# EAGLE design tick-box-1591A-mk-2.2 (EAGLE 6.5.0)
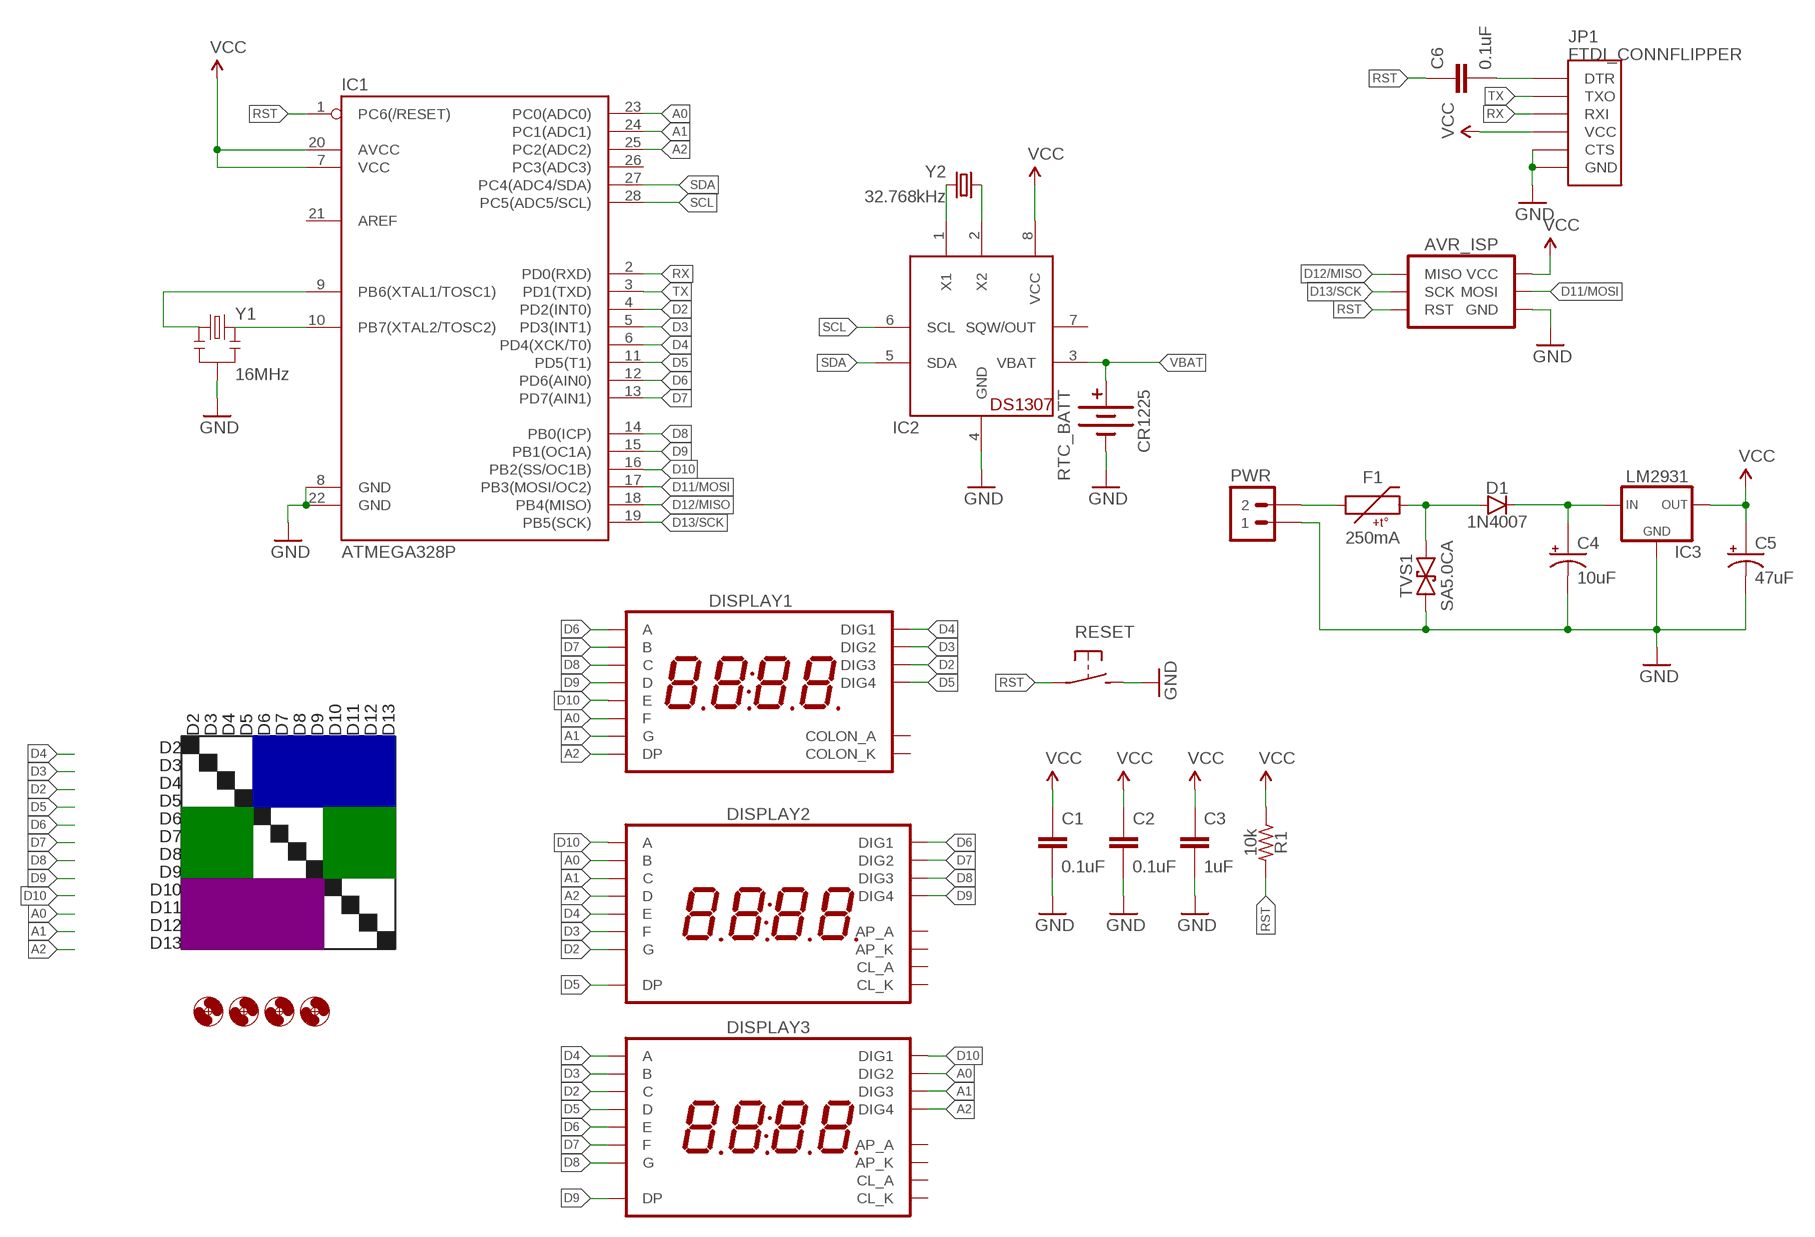
[diagram p0: schematic, sheet 1]

## Parts
AVR_ISP  AVR_SPI_PRG_6PTH  [2X3]
C1  0.1uF  CAPACITOR-CERAMIC025-024X044  [C025-024X044]
C2  0.1uF  CAPACITOR-CERAMIC025-024X044  [C025-024X044]
C3  1uF  CAPACITOR-CERAMIC025-024X044  [C025-024X044]
C4  10uF  CAPACITOR-POLARIZEDE2-5  [E2-5]
C5  47uF  CAPACITOR-POLARIZEDE2.5-6  [E2,5-6]
C6  0.1uF  CAPACITOR-CERAMIC025-024X044  [C025-024X044]
D1  1N4007  DIODEPTH-10.68MM  [DIODE-10.16MM]
DISPLAY1  7SEG_4DIGIT_COLON14.2MM-CC-NS  [7SEG_4DIG_NS]
DISPLAY2  7SEG_4DIGIT_COLON_APOS  [7SEG_4DIG_10MM]
DISPLAY3  7SEG_4DIGIT_COLON_APOS  [7SEG_4DIG_10MM]
F1  250mA  PTCPTH-5.08MM  [PTC-PTH-5.08MM]
H1  HOLE#2  [HOLE-#2]
H2  HOLE#2  [HOLE-#2]
H3  HOLE#2  [HOLE-#2]
H4  HOLE#2  [HOLE-#2]
IC1  ATMEGA328P  ATMEGA328P_PDIP  [DIL28-3]
IC2  DS1307  [DIL08]
IC3  LM2931  V_REG_78XXTO-92-INLINE  [TO-92-AMMO]
JP1  FTDI_CONNFLIPPER  [FTDI_CONN_FLIP]
PWR  M02PTH-CENTERED  [1X02-CENTER]
R1  10k  RESISTORPTH-AXIAL-6.35MM  [RESISTOR-AXIAL-PTH-6.35MM]
RESET  SPST-NO-TACT3MM-PTH-SMALL-PADS  [DTS-3-SMALL-PADS]
RTC_BATT  CR1225  BATTERY12PTH_TOPLOAD  [BATTCON_12MM_PTH_TOPLOAD]
TVS1  SA5.0CA  TVSDO-41-10.16MM  [DO-41-TVS-BI-10.16MM]
Y1  16MHz  RESONATORPTH  [RESONATOR-PTH]
Y2  32.768kHz  CRYSTALTC26H  [TC26H]

## Nets
A0: DISPLAY1.P$12(F) DISPLAY2.16(B) DISPLAY3.2(DIG2) IC1.23(PC0(ADC0))
A1: DISPLAY1.P$5(G) DISPLAY2.13(C) DISPLAY3.6(DIG3) IC1.24(PC1(ADC1))
A2: DISPLAY1.P$3(DP) DISPLAY2.3(D) DISPLAY3.8(DIG4) IC1.25(PC2(ADC2))
D2: DISPLAY1.P$10(DIG3) DISPLAY2.15(G) DISPLAY3.13(C) IC1.4(PD2(INT0))
D3: DISPLAY1.P$11(DIG2) DISPLAY2.11(F) DISPLAY3.16(B) IC1.5(PD3(INT1))
D4: DISPLAY1.P$14(DIG1) DISPLAY2.5(E) DISPLAY3.14(A) IC1.6(PD4(XCK/T0))
D5: DISPLAY1.P$6(DIG4) DISPLAY2.7(DP) DISPLAY3.3(D) IC1.11(PD5(T1))
D6: DISPLAY1.P$13(A) DISPLAY2.1(DIG1) DISPLAY3.5(E) IC1.12(PD6(AIN0))
D7: DISPLAY1.P$9(B) DISPLAY2.2(DIG2) DISPLAY3.11(F) IC1.13(PD7(AIN1))
D8: DISPLAY1.P$4(C) DISPLAY2.6(DIG3) DISPLAY3.15(G) IC1.14(PB0(ICP))
D9: DISPLAY1.P$2(D) DISPLAY2.8(DIG4) DISPLAY3.7(DP) IC1.15(PB1(OC1A))
D10: DISPLAY1.P$1(E) DISPLAY2.14(A) DISPLAY3.1(DIG1) IC1.16(PB2(SS/OC1B))
D11/MOSI: AVR_ISP.4(MOSI) IC1.17(PB3(MOSI/OC2))
D12/MISO: AVR_ISP.1(MISO) IC1.18(PB4(MISO))
D13/SCK: AVR_ISP.3(SCK) IC1.19(PB5(SCK))
GND: AVR_ISP.6(GND) C1.2 C2.2 C3.2 C4.- C5.- IC1.8(GND) IC1.22(GND) IC2.4(GND) IC3.2(GND) JP1.CTS JP1.GND PWR.1 RESET.2 RTC_BATT.- TVS1.P$1 Y1.2
N$1: IC1.10(PB7(XTAL2/TOSC2)) Y1.3
N$2: IC1.9(PB6(XTAL1/TOSC1)) Y1.1
N$3: D1.A F1.P$2 TVS1.P$2
N$4: F1.P$1 PWR.2
N$5: C4.+ D1.C IC3.1(IN)
N$6: IC2.2(X2) Y2.1
N$7: C6.2 JP1.DTR
N$8: IC2.1(X1) Y2.2
RST: AVR_ISP.5(RST) C6.1 IC1.1(PC6(/RESET)) R1.P$2 RESET.1
RX: IC1.2(PD0(RXD)) JP1.RXI
SCL: IC1.28(PC5(ADC5/SCL)) IC2.6(SCL)
SDA: IC1.27(PC4(ADC4/SDA)) IC2.5(SDA)
TX: IC1.3(PD1(TXD)) JP1.TXO
VBAT: IC2.3(VBAT) RTC_BATT.+
VCC: AVR_ISP.2(VCC) C1.1 C2.1 C3.1 C5.+ IC1.7(VCC) IC1.20(AVCC) IC2.8(VCC) IC3.3(OUT) JP1.VCC R1.P$1
Unconnected: DISPLAY1.P$7(COLON_K) DISPLAY1.P$8(COLON_A) DISPLAY2.4(CL_A) DISPLAY2.9(AP_K) DISPLAY2.10(AP_A) DISPLAY2.12(CL_K) DISPLAY3.4(CL_A) DISPLAY3.9(AP_K) DISPLAY3.10(AP_A) DISPLAY3.12(CL_K) IC1.21(AREF) IC1.26(PC3(ADC3)) IC2.7(SQW/OUT)

## Notes on the sheet
- D2 | D3 | D4 | D5 | D6 | D7 | D8 | D9 | D10 | D11 | D12 | D13
- D2
- D3
- D4
- D5
- D6
- D7
- D8
- D9
- D10
- D11
- D12
- D13

## Library data of the parts
AVR_ISP = A_butts:AVR_SPI_PRG_6: AVR ISP 6 Pin This is the reduced ISP connector for AVR programming. Common on Arduino. This footprint will take up less PCB space and can be used with a 10-pin to 6-pin adapter such as SKU: BOB-08508 **Special note about "TEST_POINT" package. The stop mask is on the top side, so if you want your programming test points to be on the bottom of your board, make sure to place this package on the bottom side of the board. This also ensure that the orientation to program from the bottom side will be correct.
C1-C3 C6 = A_butts:CAPACITOR-CERAMIC: CAPACITOR, European symbol
C4 C5 = A_butts:CAPACITOR-POLARIZED: POLARIZED CAPACITOR, American symbol
D1 = A_butts:DIODE: Diode These are standard reverse protection diodes and small signal diodes. SMA package can handle up to about 1A. SOD-323 can handle about 200mA. What the SOD-323 package when ordering, there are some mfgs out there that are 5-pin packages.
DISPLAY1 = A_butts:7SEG_4DIGIT_COLON
DISPLAY2 DISPLAY3 = A_butts:7SEG_4DIGIT_COLON_APOS
F1 = A_butts:PTC: Resettable Fuse PTC Resettable Fuse. Spark Fun Electronics SKU : COM-08357
H1-H4 = A_butts:HOLE: MOUNTING HOLE with drill center marker
IC1 = A_butts:ATMEGA328P_PDIP: uC used in the Arduino 32kb flash, 1k EEPROM, 2k SRAM This is the through-hole version of this chip.
IC2 = A_butts:DS1307: DS1307 Real time clock (RTC) with battery backup ability. Talk to it via i2c
IC3 = A_butts:V_REG_78XX: Voltage Regulator Standard 7805 5V regulator. IGO (Input Ground Output). Spark Fun Electronics SKU : COM-00107
JP1 = A_butts:FTDI_CONN: Connector which mates to FTDI basic or FTDI cable.
PWR = A_butts:M02: Standard 2-pin 0.1" header. Use with - straight break away headers ( PRT-00116) - right angle break away headers (PRT-00553) - swiss pins (PRT-00743) - machine pins (PRT-00117) - female headers (PRT-00115) Molex polarized connector foot print use with: PRT-08233 with associated crimp pins and housings. 2.54_SCREWTERM for use with PRT-10571. 3.5mm Screw Terminal footprints for PRT-08084 5mm Screw Terminal footprints for use with PRT-08433
R1 = A_butts:RESISTOR: RESISTOR, American symbol
RESET = A_butts:SPST-NO-TACT
RTC_BATT = A_butts:BATTERY: Battery Holders Various common sizes : AA, AAA, 20mm coin cell and 12mm coin cell. 20MM_4LEGS, BATT-10373
TVS1 = A_butts:TVS: Transient voltage suppressor- prevents ESD on inputs. Ignore package description- MBRA140 is NOT this type of part!!!
Y1 = A_butts:RESONATOR: Resonator Small SMD resonator. Used, eg, on the Arduino Pro/ Pro Mini boards. 8MHz- XTAL-08895 16MHz- XTAL-08900
Y2 = A_butts:CRYSTAL: Various standard crystals. Proven footprints. Spark Fun Electronics SKU : COM-00534

## Board
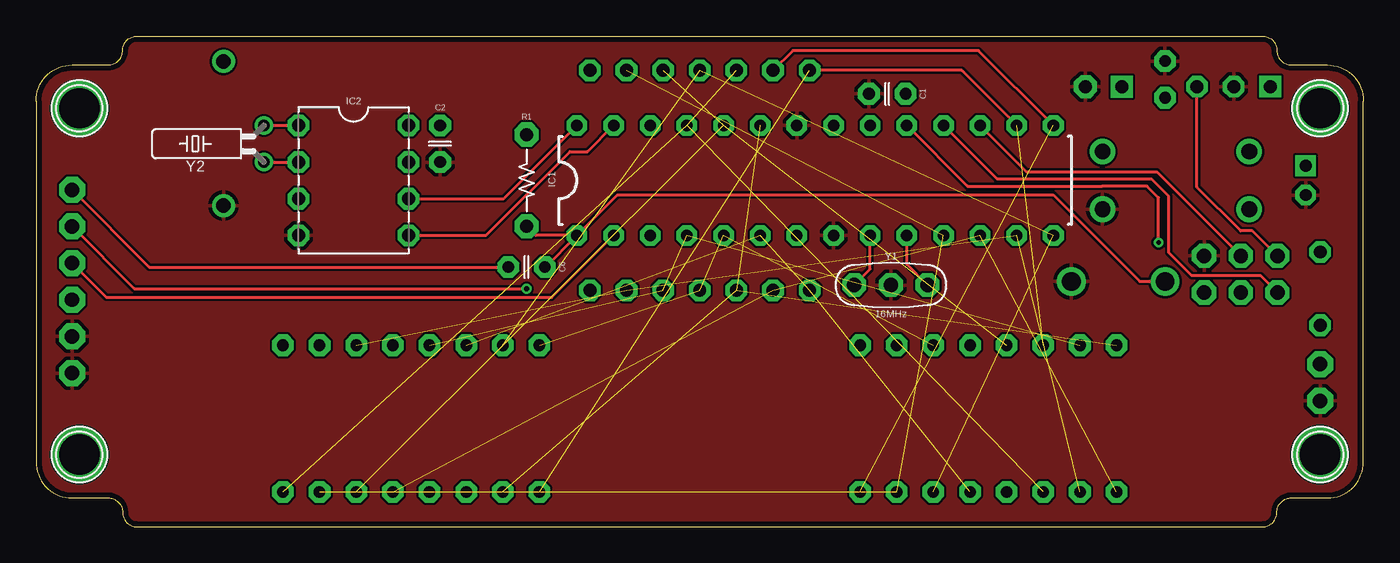
[diagram p1: board, top side]
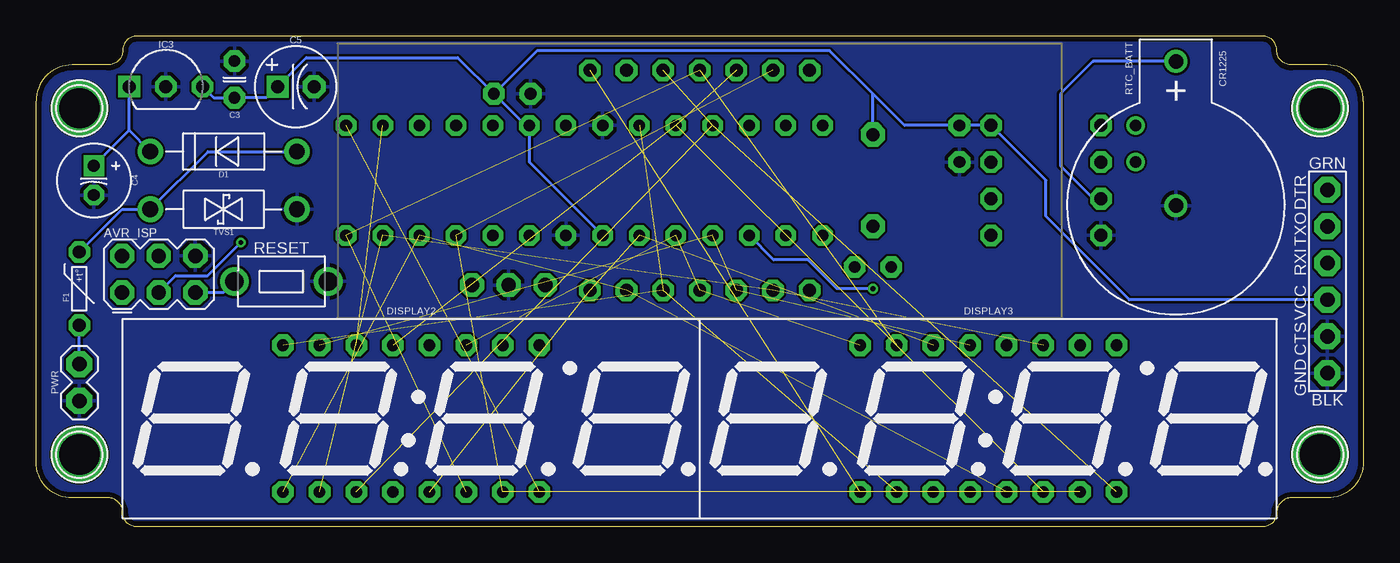
[diagram p2: board, bottom side, seen from below]

Size 92 x 34 mm. Coordinates in mm from the lower left corner, seen from the top.
Outline: 87,32 89.5,32 arc-90 92,29.5 92,4.5 arc-90 89.5,2 87,2 arc90 86,1 arc-90 85,0 7,0 arc-90 6,1 arc90 5,2 2.5,2 arc-90 0,4.5 0,29.5 arc-90 2.5,32 5,32 arc90 6,33 arc-90 7,34 85,34 arc-90 86,33 arc90 87,32
Copper layers (1*16): Top 0.0356mm / dielectric 1.5011mm / Bottom 0.0356mm
Design rules "LaenPCBOrder_2": minimum track width 6mil, minimum drill 13mil, track to track 6mil, track to pad 6mil, pad to pad 6mil, via to via 6mil, smd to smd 6mil, copper to edge 15mil, drill to drill 6mil, minimum pad ring 7mil, minimum via ring 7mil, stop-mask expansion 3mil, vias tented up to drill 20mil, thermal gap 10mil

### Footprints (pad centres in the part's own frame; a part is rotated, then mirrored left to right if it is on the bottom)
2X3 = drill 1 pad 1.676 octagon: 1 -2.54,-1.27; 2 -2.54,1.27; 3 0,-1.27; 4 0,1.27; 5 2.54,-1.27; 6 2.54,1.27
C025-024X044 = drill 0.813 pad 1.5 octagon: 1 -1.27,0; 2 1.27,0
E2-5 = drill 0.813 pad 1.422 square: + -1.016,0 | drill 0.813 pad 1.422 octagon: - 1.016,0
E2,5-6 = drill 0.9 pad 1.524 square: + -1.27,0 | drill 0.9 pad 1.6 octagon: - 1.27,0
DIODE-10.16MM = drill 1.1 pad 1.778: A -5.08,0; C 5.08,0
7SEG_4DIG_NS = drill 0.9 pad 1.5 octagon: P$1 -7.62,7.62; P$2 -5.08,7.62; P$3 -2.54,7.62; P$4 0,7.62; P$5 2.54,7.62; P$6 5.08,7.62; P$7 7.62,7.62; P$8 7.62,-7.62; P$9 5.08,-7.62; P$10 2.54,-7.62; P$11 0,-7.62; P$12 -2.54,-7.62; P$13 -5.08,-7.62; P$14 -7.62,-7.62
7SEG_4DIG_10MM = drill 0.8 pad 1.5 octagon: 1 -8.89,-5.08; 2 -6.35,-5.08; 3 -3.81,-5.08; 4 -1.27,-5.08; 5 1.27,-5.08; 6 3.81,-5.08; 7 6.35,-5.08; 8 8.89,-5.08; 9 8.89,5.08; 10 6.35,5.08; 11 3.81,5.08; 12 1.27,5.08; 13 -1.27,5.08; 14 -3.81,5.08; 15 -6.35,5.08; 16 -8.89,5.08
PTC-PTH-5.08MM = drill 0.9 pad 1.5 octagon: P$1 -2.54,0; P$2 2.54,0
HOLE-#2 = drill 2.8 pad 3.81: P$1 0,0
DIL28-3 = drill 0.8 pad 1.422 octagon: 1 -16.51,-3.81; 2 -13.97,-3.81; 3 -11.43,-3.81; 4 -8.89,-3.81; 5 -6.35,-3.81; 6 -3.81,-3.81; 7 -1.27,-3.81; 8 1.27,-3.81; 9 3.81,-3.81; 10 6.35,-3.81; 11 8.89,-3.81; 12 11.43,-3.81; 13 13.97,-3.81; 14 16.51,-3.81; 15 16.51,3.81; 16 13.97,3.81; 17 11.43,3.81; 18 8.89,3.81; 19 6.35,3.81; 20 3.81,3.81; 21 1.27,3.81; 22 -1.27,3.81; 23 -3.81,3.81; 24 -6.35,3.81; 25 -8.89,3.81; 26 -11.43,3.81; 27 -13.97,3.81; 28 -16.51,3.81
DIL08 = drill 0.9 pad 1.5 octagon: 1 -3.81,-3.81; 2 -1.27,-3.81; 3 1.27,-3.81; 4 3.81,-3.81; 5 3.81,3.81; 6 1.27,3.81; 7 -1.27,3.81; 8 -3.81,3.81
TO-92-AMMO = drill 0.9 pad 1.5 square: 1 -2.54,0 | drill 0.9 pad 1.5 octagon: 2 0,0; 3 2.54,0
FTDI_CONN_FLIP = drill 1 pad 1.8 octagon: CTS 3.81,0; DTR -6.35,0; GND 6.35,0; RXI -1.27,0; TXO -3.81,0; VCC 1.27,0
1X02-CENTER = drill 1 pad 1.8 octagon: 1 -1.27,0; 2 1.27,0
RESISTOR-AXIAL-PTH-6.35MM = drill 0.9 pad 1.676 octagon: P$1 -3.175,0; P$2 3.175,0
DTS-3-SMALL-PADS = drill 1.3 pad 2: 1 -3.25,0; 2 3.25,0
BATTCON_12MM_PTH_TOPLOAD = drill 1 pad 1.6: + 10,0; - 0,0
DO-41-TVS-BI-10.16MM = drill 1.1 pad 1.778: P$1 -5.08,0; P$2 5.08,0
RESONATOR-PTH = drill 1 pad 1.65 octagon: 1 -2.54,0; 2 0,0; 3 2.54,0
TC26H = drill 0.8 pad 1.27: 1 -1.27,0; 2 1.27,0

### Placement (x,y rotation side)
AVR_ISP  83.5,17.5 0 bottom
C1  59,30 180 top
C2  28,26.54 270 top
C3  78.25,31 90 bottom
C4  88,24 270 bottom
C5  74,30.5 0 bottom
C6  34,18 180 top
D1  79,26 180 bottom
DISPLAY1  46,24 0 bottom
DISPLAY2  66,7.5 0 bottom
DISPLAY3  26,7.5 0 bottom
F1  89,16.5 90 bottom
H1  3,5 0 top
H2  89,5 0 top
H3  89,29 0 top
H4  3,29 0 top
IC1  54,24 0 top
IC2  22,24 270 top
IC3  83,30.5 0 bottom
JP1  2.5,17 270 bottom
PWR  89,10 90 bottom
R1  34,24 270 top
RESET  75,17 0 bottom
RTC_BATT  13,22.25 90 bottom
TVS1  79,22 180 bottom
Y1  59.25,16.75 0 top
Y2  15.8,26.54 90 top

### Tracks (layer width: path | path; a pad name or v marks a point on that pad's centre or on a via)
A0  (3 unrouted)
A1  (3 unrouted)
A2  (3 unrouted)
D2  (3 unrouted)
D3  (3 unrouted)
D4  (3 unrouted)
D5  (3 unrouted)
D6  (3 unrouted)
D7  (3 unrouted)
D8  (3 unrouted)
D9  (2 unrouted)
  Top 0.2: DISPLAY1.P$2 52.46,33 65.32,33 IC1.15
D10  (2 unrouted)
  Top 0.2: IC1.16 64.16,31.62 DISPLAY1.P$1
D11/MOSI
  Top 0.2: AVR_ISP.4 77.67,24.6 68.64,24.6 IC1.17
D12/MISO
  Top 0.2: AVR_ISP.1 84.87,17.4 80.1,17.4 78.5,19 78.5,22.9 77.3,24.1 66.6,24.1 IC1.18
D13/SCK  (via drill 0.33)
  Top 0.2: v77.8,19.7 77.8,22.8 77,23.6 74.1,23.6 73.9,23.6 64.56,23.6 IC1.19
  Bottom 0.2: AVR_ISP.3 82.33,17.4 80.1,17.4 v77.8,19.7
GND
  pour Top: 6,1 arc90 7,0 85,0 arc90 86,1 arc-90 87,2 89.5,2 arc90 92,4.5 92,29.5 arc90 89.5,32 87,32 arc-90 86,33 arc90 85,34 7,34 arc90 6,33 arc-90 5,32 2.5,32 arc90 0,29.5 0,4.5 arc90 2.5,2 5,2 arc-90
  pour Bottom: 6,1 arc90 7,0 85,0 arc90 86,1 arc-90 87,2 89.5,2 arc90 92,4.5 92,29.5 arc90 89.5,32 87,32 arc-90 86,33 arc90 85,34 7,34 arc90 6,33 arc-90 5,32 2.5,32 arc90 0,29.5 0,4.5 arc90 2.5,2 5,2 arc-90
N$1
  Top 0.2: Y1.3 60.35,18.19 IC1.10
N$2
  Top 0.2: Y1.1 57.81,17.85 IC1.9
N$3
  Bottom 0.2: F1.P$2 86.04,22 TVS1.P$2 80.08,26 D1.A
N$4
  Bottom 0.2: PWR.2 F1.P$1
N$5
  Bottom 0.2: D1.C 85.54,27.46 IC3.1 85.54,27.48 C4.+
N$6
  Top 0.2: Y2.1 IC2.2
N$7
  Top 0.2: JP1.DTR 7.85,18 C6.2
N$8
  Top 0.2: Y2.2 IC2.1
RST
  Top 0.2: IC1.1 40.3,23 70.5,23 76.5,17 RESET.1 | IC1.1 34.63,20.19 R1.P$2 | C6.1 35.3,18 IC1.1
  Bottom 0.2: RESET.1 79.02,16.23 AVR_ISP.5
RX
  Top 0.2: JP1.RXI 4.87,15.9 35.74,15.9 IC1.2
SCL
  Top 0.2: IC2.6 32.41,22.73 IC1.28
SDA
  Top 0.2: IC2.5 31.19,20.19 37,26 38.22,26 IC1.27
TX  (via drill 0.33)
  Top 0.2: JP1.TXO 6.81,16.5 v34,16.5
  Bottom 0.2: v34,16.5 36.5,16.5 38.5,18.5 40.88,18.5 IC1.3
VBAT
  Bottom 0.2: RTC_BATT.+ 18.75,32.25 21,30 21,25 18.73,22.73 IC2.3
VCC
  Top 0.2: AVR_ISP.2 84.31,20.5 83.5,20.5 80.46,23.54 IC3.3
  Bottom 0.2: IC3.3 79.69,29.73 C3.1 76.04,29.73 C5.+ 73.27,32.5 62.77,32.5 C1.1 | C1.1 58.08,27.81 | IC1.7 57.81,25.27 IC1.20 | R1.P$1 34,30 | 34,30 37,33 57.27,33 C1.1 | 34,30 31.81,27.81 C2.1 IC2.8 22,24 22,21.5 16.23,15.73 JP1.VCC
  Bottom 0.4: 58.08,27.81 IC1.20